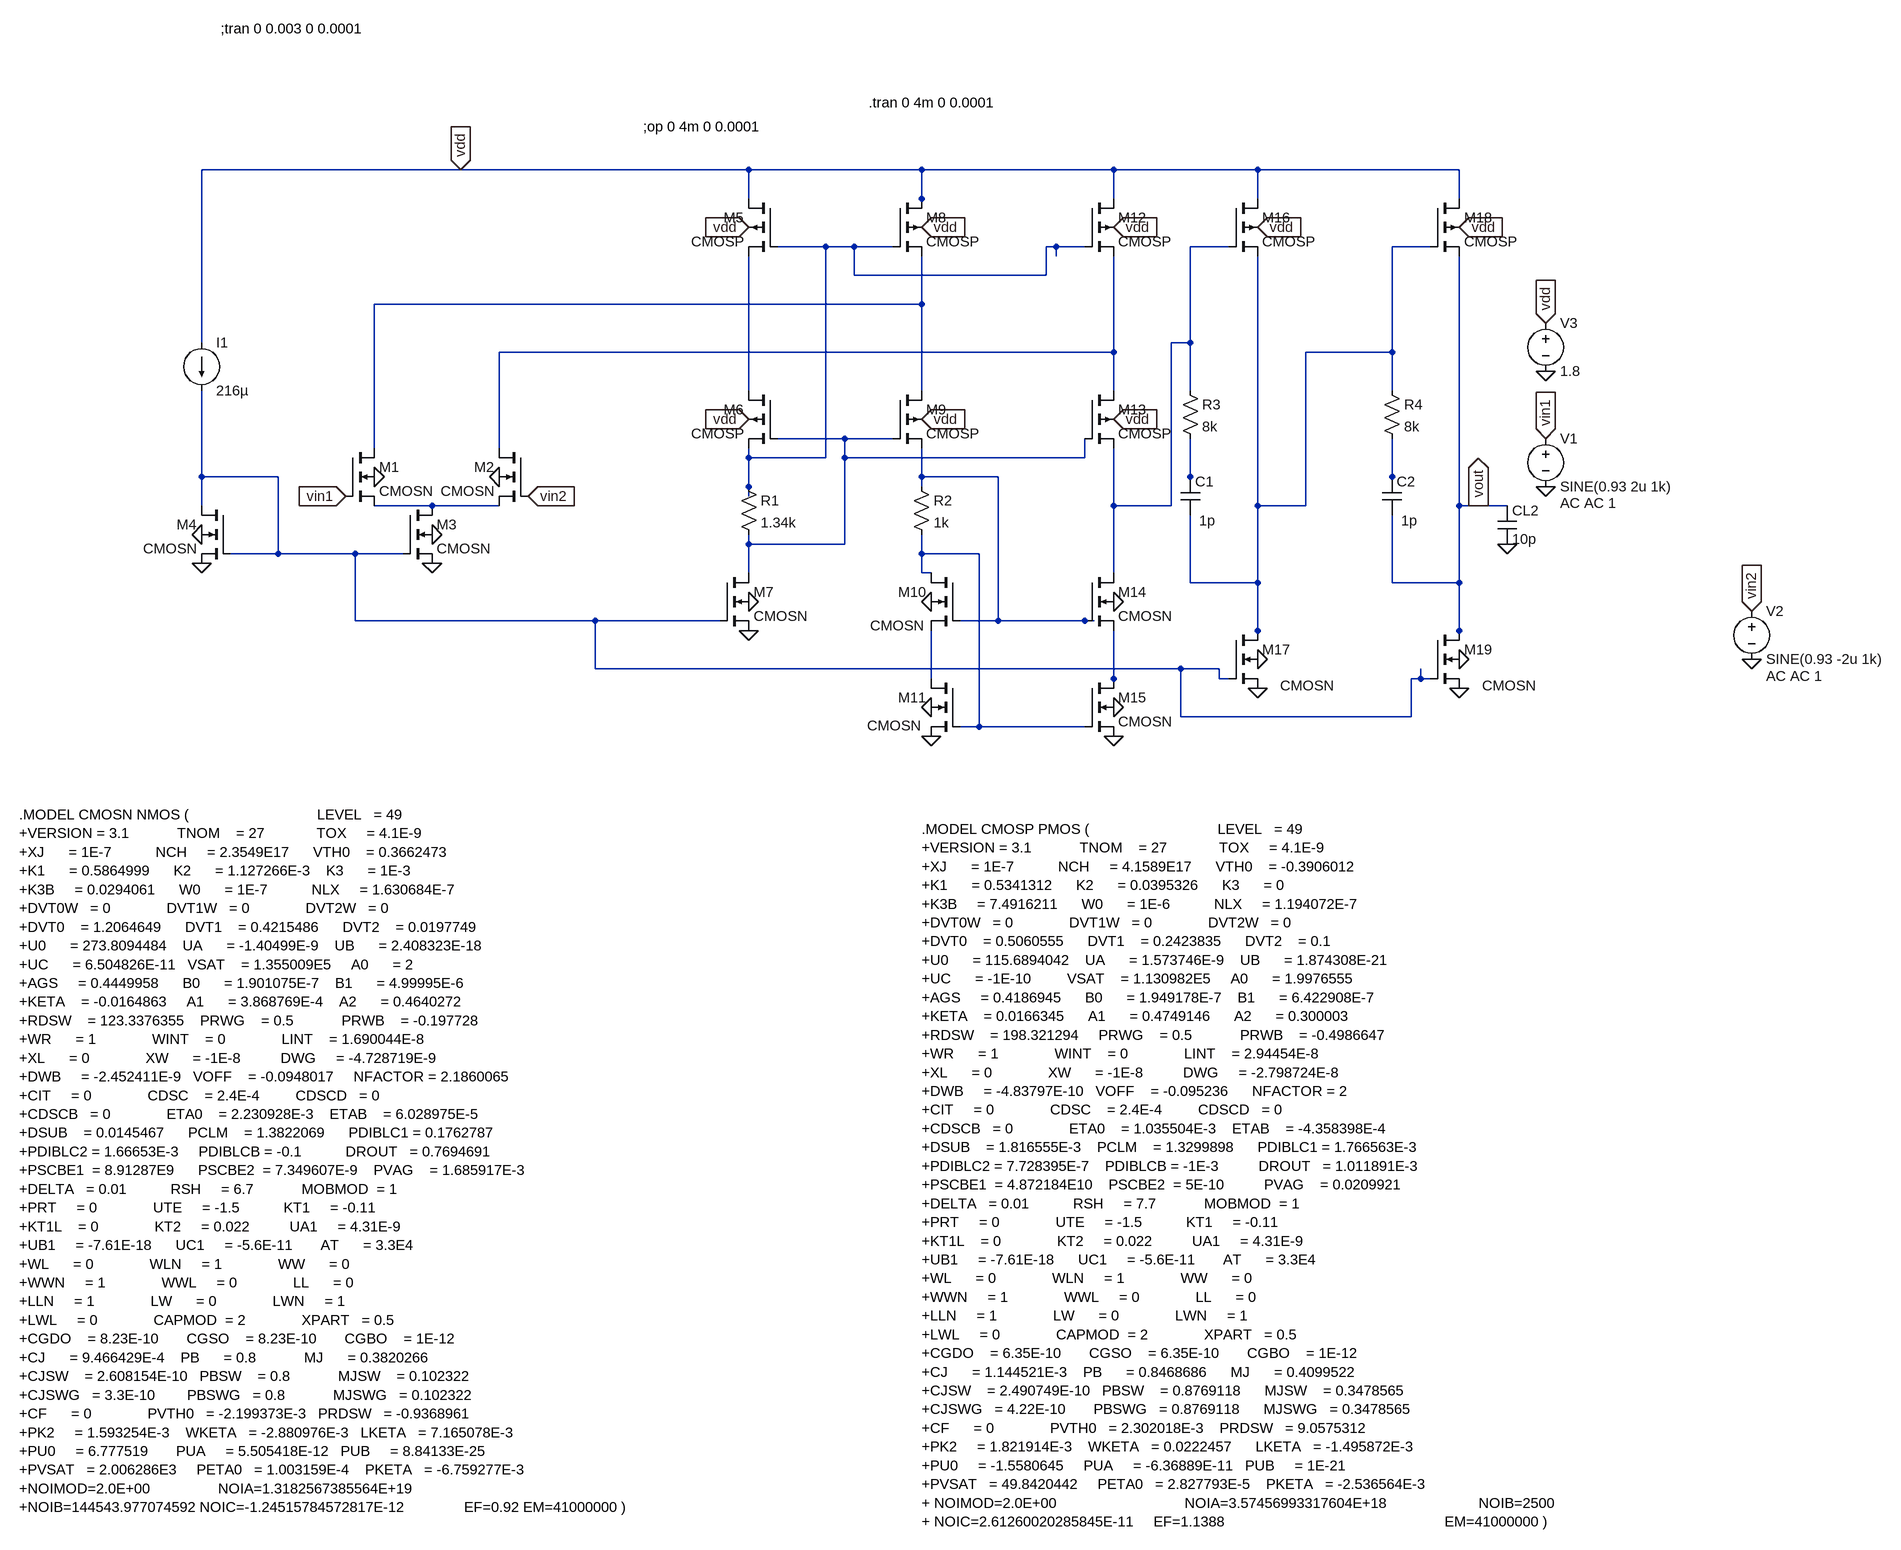
[diagram p0: schematic 3stagefc.asc]
3stagefc.asc, the LTspice schematic file:
Version 4
SHEET 1 2076 2348
WIRE -704 -128 -1136 -128
WIRE -224 -128 -704 -128
WIRE 64 -128 -224 -128
WIRE 384 -128 64 -128
WIRE 624 -128 384 -128
WIRE 960 -128 624 -128
WIRE -224 -80 -224 -128
WIRE 64 -80 64 -128
WIRE 384 -80 384 -128
WIRE 624 -80 624 -128
WIRE 960 -80 960 -128
WIRE 64 -64 64 -80
WIRE -96 0 -176 0
WIRE -48 0 -96 0
WIRE 16 0 -48 0
WIRE 288 0 272 0
WIRE 336 0 288 0
WIRE 576 0 512 0
WIRE 912 0 848 0
WIRE 288 16 288 0
WIRE -48 48 -48 0
WIRE 272 48 272 0
WIRE 272 48 -48 48
WIRE 64 96 64 16
WIRE 64 96 -848 96
WIRE -1136 160 -1136 -128
WIRE 512 160 512 0
WIRE 512 160 480 160
WIRE 384 176 384 16
WIRE 384 176 -640 176
WIRE 848 176 848 0
WIRE 848 176 704 176
WIRE -224 240 -224 16
WIRE 64 240 64 96
WIRE 384 240 384 176
WIRE 512 240 512 160
WIRE 848 240 848 176
WIRE -64 320 -176 320
WIRE 16 320 -64 320
WIRE -848 336 -848 96
WIRE -640 336 -640 176
WIRE -224 352 -224 336
WIRE -96 352 -96 0
WIRE -96 352 -224 352
WIRE -64 352 -64 320
WIRE 336 352 336 320
WIRE 336 352 -64 352
WIRE -1136 384 -1136 240
WIRE -1008 384 -1136 384
WIRE 64 384 64 336
WIRE 192 384 64 384
WIRE 512 384 512 320
WIRE 848 384 848 320
WIRE -224 400 -224 352
WIRE 64 400 64 384
WIRE 512 400 512 384
WIRE 848 400 848 384
WIRE -224 416 -224 400
WIRE -1136 432 -1136 384
WIRE -752 432 -848 432
WIRE -640 432 -752 432
WIRE 384 432 384 336
WIRE 480 432 480 160
WIRE 480 432 384 432
WIRE 624 432 624 16
WIRE 704 432 704 176
WIRE 704 432 624 432
WIRE 960 432 960 16
WIRE 992 432 960 432
WIRE 1040 432 992 432
WIRE -224 496 -224 480
WIRE -64 496 -64 352
WIRE -64 496 -224 496
WIRE -1008 512 -1008 384
WIRE -1008 512 -1088 512
WIRE -880 512 -1008 512
WIRE -800 512 -880 512
WIRE 64 512 64 480
WIRE 160 512 64 512
WIRE -224 544 -224 496
WIRE 64 544 64 512
WIRE 80 544 64 544
WIRE 384 544 384 432
WIRE 512 560 512 448
WIRE 624 560 624 432
WIRE 624 560 512 560
WIRE 848 560 848 448
WIRE 960 560 960 432
WIRE 960 560 848 560
WIRE -880 624 -880 512
WIRE -480 624 -880 624
WIRE -272 624 -480 624
WIRE 192 624 192 384
WIRE 192 624 128 624
WIRE 336 624 192 624
WIRE 352 624 336 624
WIRE 624 640 624 560
WIRE 960 640 960 560
WIRE 624 656 624 640
WIRE 960 656 960 640
WIRE -480 704 -480 624
WIRE 496 704 -480 704
WIRE 560 704 496 704
WIRE 80 720 80 640
WIRE 384 720 384 640
WIRE 560 720 560 704
WIRE 576 720 560 720
WIRE 896 720 896 704
WIRE 896 720 880 720
WIRE 912 720 896 720
WIRE 384 736 384 720
WIRE 496 784 496 704
WIRE 880 784 880 720
WIRE 880 784 496 784
WIRE 160 800 160 512
WIRE 160 800 128 800
WIRE 336 800 160 800
FLAG -752 528 0
FLAG -752 480 0
FLAG -848 384 0
FLAG -640 384 0
FLAG -896 416 vin1
IOPIN -896 416 In
FLAG -592 416 vin2
IOPIN -592 416 In
FLAG 1104 320 vin1
IOPIN 1104 320 In
FLAG 1104 400 0
FLAG 1824 688 0
FLAG 1824 608 vin2
IOPIN 1824 608 In
FLAG 1104 128 vdd
IOPIN 1104 128 In
FLAG 1104 208 0
FLAG -1136 528 0
FLAG -1136 480 0
FLAG -224 -32 vdd
IOPIN -224 -32 In
FLAG -224 288 vdd
IOPIN -224 288 In
FLAG -224 640 0
FLAG -224 592 0
FLAG 80 592 0
FLAG 80 816 0
FLAG 80 768 0
FLAG 64 288 vdd
IOPIN 64 288 In
FLAG 64 -32 vdd
IOPIN 64 -32 In
FLAG 384 816 0
FLAG 384 768 0
FLAG 624 688 0
FLAG 624 736 0
FLAG 384 592 0
FLAG 384 288 vdd
IOPIN 384 288 In
FLAG 384 -32 vdd
IOPIN 384 -32 In
FLAG 624 -32 vdd
IOPIN 624 -32 In
FLAG -704 -128 vdd
IOPIN -704 -128 In
FLAG 960 688 0
FLAG 960 736 0
FLAG 960 -32 vdd
IOPIN 960 -32 In
FLAG 1040 496 0
FLAG 992 432 vout
IOPIN 992 432 Out
SYMBOL nmos4 -896 336 R0
SYMATTR InstName M1
SYMATTR Value CMOSN
SYMATTR Value2 l=0.5u w=30u
SYMBOL nmos4 -592 336 M0
SYMATTR InstName M2
SYMATTR Value CMOSN
SYMATTR Value2 l=0.5u w=30u
SYMBOL nmos4 -800 432 R0
SYMATTR InstName M3
SYMATTR Value CMOSN
SYMATTR Value2 l=0.5u w=7u
SYMBOL voltage 1104 304 R0
WINDOW 123 24 124 Left 2
WINDOW 39 0 0 Left 0
SYMATTR Value2 AC AC 1
SYMATTR InstName V1
SYMATTR Value SINE(0.93 2u 1k)
SYMBOL voltage 1824 592 R0
WINDOW 123 24 124 Left 2
WINDOW 39 0 0 Left 0
SYMATTR Value2 AC AC 1
SYMATTR InstName V2
SYMATTR Value SINE(0.93 -2u 1k)
SYMBOL voltage 1104 112 R0
WINDOW 123 0 0 Left 0
WINDOW 39 0 0 Left 0
SYMATTR InstName V3
SYMATTR Value 1.8
SYMBOL nmos4 -1088 432 M0
SYMATTR InstName M4
SYMATTR Value CMOSN
SYMATTR Value2 l=0.5u w=7u
SYMBOL current -1136 160 R0
WINDOW 123 0 0 Left 0
WINDOW 39 0 0 Left 0
SYMATTR InstName I1
SYMATTR Value 216µ
SYMBOL pmos4 -176 -80 M0
SYMATTR InstName M5
SYMATTR Value CMOSP
SYMATTR Value2 l=0.3u w=170u
SYMBOL pmos4 -176 240 M0
SYMATTR InstName M6
SYMATTR Value CMOSP
SYMATTR Value2 l=0.3u w=170u
SYMBOL nmos4 -272 544 R0
SYMATTR InstName M7
SYMATTR Value CMOSN
SYMATTR Value2 l=0.5u w=9u
SYMBOL res -240 384 R0
SYMATTR InstName R1
SYMATTR Value 1.34k
SYMBOL pmos4 16 -80 R0
SYMATTR InstName M8
SYMATTR Value CMOSP
SYMATTR Value2 l=0.3u w=170u
SYMBOL pmos4 16 240 R0
SYMATTR InstName M9
SYMATTR Value CMOSP
SYMATTR Value2 l=0.3u w=170u
SYMBOL res 48 384 R0
SYMATTR InstName R2
SYMATTR Value 1k
SYMBOL nmos4 128 544 M0
WINDOW 3 60 88 Left 2
SYMATTR Value CMOSN
SYMATTR InstName M10
SYMATTR Value2 l=0.5u w=70u
SYMBOL nmos4 128 720 M0
WINDOW 3 65 79 Left 2
SYMATTR Value CMOSN
SYMATTR InstName M11
SYMATTR Value2 l=0.5u w=70u
SYMBOL pmos4 336 -80 R0
SYMATTR InstName M12
SYMATTR Value CMOSP
SYMATTR Value2 l=0.3u w=170u
SYMBOL pmos4 336 240 R0
SYMATTR InstName M13
SYMATTR Value CMOSP
SYMATTR Value2 l=0.3u w=170u
SYMBOL nmos4 336 544 R0
SYMATTR InstName M14
SYMATTR Value CMOSN
SYMATTR Value2 l=0.5u w=70u
SYMBOL nmos4 336 720 R0
SYMATTR InstName M15
SYMATTR Value CMOSN
SYMATTR Value2 l=0.5u w=70u
SYMBOL pmos4 576 -80 R0
SYMATTR InstName M16
SYMATTR Value CMOSP
SYMATTR Value2 l=0.5u w=30u
SYMBOL nmos4 576 640 R0
WINDOW 3 86 92 Left 2
SYMATTR Value CMOSN
SYMATTR InstName M17
SYMATTR Value2 l=0.5u w=30u
SYMBOL cap 496 384 R0
WINDOW 3 31 73 Left 2
SYMATTR Value 1p
SYMATTR InstName C1
SYMBOL res 496 224 R0
SYMATTR InstName R3
SYMATTR Value 8k
SYMBOL pmos4 912 -80 R0
SYMATTR InstName M18
SYMATTR Value CMOSP
SYMATTR Value2 l=0.5u w=10u
SYMBOL nmos4 912 640 R0
WINDOW 3 86 92 Left 2
SYMATTR Value CMOSN
SYMATTR InstName M19
SYMATTR Value2 l=0.5u w=10u
SYMBOL cap 832 384 R0
WINDOW 3 31 73 Left 2
SYMATTR Value 1p
SYMATTR InstName C2
SYMBOL cap 1024 432 R0
SYMATTR InstName CL2
SYMATTR Value 10p
SYMBOL res 832 224 R0
SYMATTR InstName R4
SYMATTR Value 8k
TEXT -1104 -480 Left 2 !;tran 0 0.003 0 0.0001
TEXT -24 -240 Left 2 !.tran 0 4m 0 0.0001
TEXT -1440 1272 Left 2 !.MODEL CMOSN NMOS (                                LEVEL   = 49\n+VERSION = 3.1            TNOM    = 27             TOX     = 4.1E-9\n+XJ      = 1E-7           NCH     = 2.3549E17      VTH0    = 0.3662473\n+K1      = 0.5864999      K2      = 1.127266E-3    K3      = 1E-3\n+K3B     = 0.0294061      W0      = 1E-7           NLX     = 1.630684E-7\n+DVT0W   = 0              DVT1W   = 0              DVT2W   = 0\n+DVT0    = 1.2064649      DVT1    = 0.4215486      DVT2    = 0.0197749\n+U0      = 273.8094484    UA      = -1.40499E-9    UB      = 2.408323E-18\n+UC      = 6.504826E-11   VSAT    = 1.355009E5     A0      = 2\n+AGS     = 0.4449958      B0      = 1.901075E-7    B1      = 4.99995E-6\n+KETA    = -0.0164863     A1      = 3.868769E-4    A2      = 0.4640272\n+RDSW    = 123.3376355    PRWG    = 0.5            PRWB    = -0.197728\n+WR      = 1              WINT    = 0              LINT    = 1.690044E-8\n+XL      = 0              XW      = -1E-8          DWG     = -4.728719E-9\n+DWB     = -2.452411E-9   VOFF    = -0.0948017     NFACTOR = 2.1860065\n+CIT     = 0              CDSC    = 2.4E-4         CDSCD   = 0\n+CDSCB   = 0              ETA0    = 2.230928E-3    ETAB    = 6.028975E-5\n+DSUB    = 0.0145467      PCLM    = 1.3822069      PDIBLC1 = 0.1762787\n+PDIBLC2 = 1.66653E-3     PDIBLCB = -0.1           DROUT   = 0.7694691\n+PSCBE1  = 8.91287E9      PSCBE2  = 7.349607E-9    PVAG    = 1.685917E-3\n+DELTA   = 0.01           RSH     = 6.7            MOBMOD  = 1\n+PRT     = 0              UTE     = -1.5           KT1     = -0.11\n+KT1L    = 0              KT2     = 0.022          UA1     = 4.31E-9\n+UB1     = -7.61E-18      UC1     = -5.6E-11       AT      = 3.3E4\n+WL      = 0              WLN     = 1              WW      = 0\n+WWN     = 1              WWL     = 0              LL      = 0\n+LLN     = 1              LW      = 0              LWN     = 1\n+LWL     = 0              CAPMOD  = 2              XPART   = 0.5\n+CGDO    = 8.23E-10       CGSO    = 8.23E-10       CGBO    = 1E-12\n+CJ      = 9.466429E-4    PB      = 0.8            MJ      = 0.3820266\n+CJSW    = 2.608154E-10   PBSW    = 0.8            MJSW    = 0.102322\n+CJSWG   = 3.3E-10        PBSWG   = 0.8            MJSWG   = 0.102322\n+CF      = 0              PVTH0   = -2.199373E-3   PRDSW   = -0.9368961\n+PK2     = 1.593254E-3    WKETA   = -2.880976E-3   LKETA   = 7.165078E-3\n+PU0     = 6.777519       PUA     = 5.505418E-12   PUB     = 8.84133E-25\n+PVSAT   = 2.006286E3     PETA0   = 1.003159E-4    PKETA   = -6.759277E-3\n+NOIMOD=2.0E+00                 NOIA=1.3182567385564E+19\n+NOIB=144543.977074592 NOIC=-1.24515784572817E-12               EF=0.92 EM=41000000 )
TEXT 64 1296 Left 2 !.MODEL CMOSP PMOS (                                LEVEL   = 49\n+VERSION = 3.1            TNOM    = 27             TOX     = 4.1E-9\n+XJ      = 1E-7           NCH     = 4.1589E17      VTH0    = -0.3906012\n+K1      = 0.5341312      K2      = 0.0395326      K3      = 0\n+K3B     = 7.4916211      W0      = 1E-6           NLX     = 1.194072E-7\n+DVT0W   = 0              DVT1W   = 0              DVT2W   = 0\n+DVT0    = 0.5060555      DVT1    = 0.2423835      DVT2    = 0.1\n+U0      = 115.6894042    UA      = 1.573746E-9    UB      = 1.874308E-21\n+UC      = -1E-10         VSAT    = 1.130982E5     A0      = 1.9976555\n+AGS     = 0.4186945      B0      = 1.949178E-7    B1      = 6.422908E-7\n+KETA    = 0.0166345      A1      = 0.4749146      A2      = 0.300003\n+RDSW    = 198.321294     PRWG    = 0.5            PRWB    = -0.4986647\n+WR      = 1              WINT    = 0              LINT    = 2.94454E-8\n+XL      = 0              XW      = -1E-8          DWG     = -2.798724E-8\n+DWB     = -4.83797E-10   VOFF    = -0.095236      NFACTOR = 2\n+CIT     = 0              CDSC    = 2.4E-4         CDSCD   = 0\n+CDSCB   = 0              ETA0    = 1.035504E-3    ETAB    = -4.358398E-4\n+DSUB    = 1.816555E-3    PCLM    = 1.3299898      PDIBLC1 = 1.766563E-3\n+PDIBLC2 = 7.728395E-7    PDIBLCB = -1E-3          DROUT   = 1.011891E-3\n+PSCBE1  = 4.872184E10    PSCBE2  = 5E-10          PVAG    = 0.0209921\n+DELTA   = 0.01           RSH     = 7.7            MOBMOD  = 1\n+PRT     = 0              UTE     = -1.5           KT1     = -0.11\n+KT1L    = 0              KT2     = 0.022          UA1     = 4.31E-9\n+UB1     = -7.61E-18      UC1     = -5.6E-11       AT      = 3.3E4\n+WL      = 0              WLN     = 1              WW      = 0\n+WWN     = 1              WWL     = 0              LL      = 0\n+LLN     = 1              LW      = 0              LWN     = 1\n+LWL     = 0              CAPMOD  = 2              XPART   = 0.5\n+CGDO    = 6.35E-10       CGSO    = 6.35E-10       CGBO    = 1E-12\n+CJ      = 1.144521E-3    PB      = 0.8468686      MJ      = 0.4099522\n+CJSW    = 2.490749E-10   PBSW    = 0.8769118      MJSW    = 0.3478565\n+CJSWG   = 4.22E-10       PBSWG   = 0.8769118      MJSWG   = 0.3478565\n+CF      = 0              PVTH0   = 2.302018E-3    PRDSW   = 9.0575312\n+PK2     = 1.821914E-3    WKETA   = 0.0222457      LKETA   = -1.495872E-3\n+PU0     = -1.5580645     PUA     = -6.36889E-11   PUB     = 1E-21\n+PVSAT   = 49.8420442     PETA0   = 2.827793E-5    PKETA   = -2.536564E-3 \n+ NOIMOD=2.0E+00                                NOIA=3.57456993317604E+18                       NOIB=2500\n+ NOIC=2.61260020285845E-11     EF=1.1388                                                       EM=41000000 )
TEXT -400 -200 Left 2 !;op 0 4m 0 0.0001

The netlist it stands for:
* 3stagefc.asc
M1 N004 vin1 N012 0 CMOSN l=0.5u w=30u
M2 N005 vin2 N012 0 CMOSN l=0.5u w=30u
M3 N012 N008 0 0 CMOSN l=0.5u w=7u
V1 vin1 0 SINE(0.93 2u 1k) AC AC 1
V2 vin2 0 SINE(0.93 -2u 1k) AC AC 1
V3 vdd 0 1.8
M4 N008 N008 0 0 CMOSN l=0.5u w=7u
I1 vdd N008 216µ
M5 vdd N001 N006 vdd CMOSP l=0.3u w=170u
M6 N006 N007 N001 vdd CMOSP l=0.3u w=170u
M7 N007 N008 0 0 CMOSN l=0.5u w=9u
R1 N001 N007 1.34k
M8 vdd N001 N004 vdd CMOSP l=0.3u w=170u
M9 N004 N007 N009 vdd CMOSP l=0.3u w=170u
R2 N009 N013 1k
M10 N013 N009 N014 0 CMOSN l=0.5u w=70u
M11 N014 N013 0 0 CMOSN l=0.5u w=70u
M12 vdd N001 N005 vdd CMOSP l=0.3u w=170u
M13 N005 N007 N002 vdd CMOSP l=0.3u w=170u
M14 N002 N009 N015 0 CMOSN l=0.5u w=70u
M15 N015 N013 0 0 CMOSN l=0.5u w=70u
M16 vdd N002 N003 vdd CMOSP l=0.5u w=30u
M17 N003 N008 0 0 CMOSN l=0.5u w=30u
C1 N010 N003 1p
R3 N002 N010 8k
M18 vdd N003 vout vdd CMOSP l=0.5u w=10u
M19 vout N008 0 0 CMOSN l=0.5u w=10u
C2 N011 vout 1p
CL2 vout 0 10p
R4 N003 N011 8k
.model NMOS NMOS
.model PMOS PMOS
.lib standard.mos
;tran 0 0.003 0 0.0001
.tran 0 4m 0 0.0001
.MODEL CMOSN NMOS (                                LEVEL   = 49
+VERSION = 3.1            TNOM    = 27             TOX     = 4.1E-9
+XJ      = 1E-7           NCH     = 2.3549E17      VTH0    = 0.3662473
+K1      = 0.5864999      K2      = 1.127266E-3    K3      = 1E-3
+K3B     = 0.0294061      W0      = 1E-7           NLX     = 1.630684E-7
+DVT0W   = 0              DVT1W   = 0              DVT2W   = 0
+DVT0    = 1.2064649      DVT1    = 0.4215486      DVT2    = 0.0197749
+U0      = 273.8094484    UA      = -1.40499E-9    UB      = 2.408323E-18
+UC      = 6.504826E-11   VSAT    = 1.355009E5     A0      = 2
+AGS     = 0.4449958      B0      = 1.901075E-7    B1      = 4.99995E-6
+KETA    = -0.0164863     A1      = 3.868769E-4    A2      = 0.4640272
+RDSW    = 123.3376355    PRWG    = 0.5            PRWB    = -0.197728
+WR      = 1              WINT    = 0              LINT    = 1.690044E-8
+XL      = 0              XW      = -1E-8          DWG     = -4.728719E-9
+DWB     = -2.452411E-9   VOFF    = -0.0948017     NFACTOR = 2.1860065
+CIT     = 0              CDSC    = 2.4E-4         CDSCD   = 0
+CDSCB   = 0              ETA0    = 2.230928E-3    ETAB    = 6.028975E-5
+DSUB    = 0.0145467      PCLM    = 1.3822069      PDIBLC1 = 0.1762787
+PDIBLC2 = 1.66653E-3     PDIBLCB = -0.1           DROUT   = 0.7694691
+PSCBE1  = 8.91287E9      PSCBE2  = 7.349607E-9    PVAG    = 1.685917E-3
+DELTA   = 0.01           RSH     = 6.7            MOBMOD  = 1
+PRT     = 0              UTE     = -1.5           KT1     = -0.11
+KT1L    = 0              KT2     = 0.022          UA1     = 4.31E-9
+UB1     = -7.61E-18      UC1     = -5.6E-11       AT      = 3.3E4
+WL      = 0              WLN     = 1              WW      = 0
+WWN     = 1              WWL     = 0              LL      = 0
+LLN     = 1              LW      = 0              LWN     = 1
+LWL     = 0              CAPMOD  = 2              XPART   = 0.5
+CGDO    = 8.23E-10       CGSO    = 8.23E-10       CGBO    = 1E-12
+CJ      = 9.466429E-4    PB      = 0.8            MJ      = 0.3820266
+CJSW    = 2.608154E-10   PBSW    = 0.8            MJSW    = 0.102322
+CJSWG   = 3.3E-10        PBSWG   = 0.8            MJSWG   = 0.102322
+CF      = 0              PVTH0   = -2.199373E-3   PRDSW   = -0.9368961
+PK2     = 1.593254E-3    WKETA   = -2.880976E-3   LKETA   = 7.165078E-3
+PU0     = 6.777519       PUA     = 5.505418E-12   PUB     = 8.84133E-25
+PVSAT   = 2.006286E3     PETA0   = 1.003159E-4    PKETA   = -6.759277E-3
+NOIMOD=2.0E+00                 NOIA=1.3182567385564E+19
+NOIB=144543.977074592 NOIC=-1.24515784572817E-12               EF=0.92 EM=41000000 )
.MODEL CMOSP PMOS (                                LEVEL   = 49
+VERSION = 3.1            TNOM    = 27             TOX     = 4.1E-9
+XJ      = 1E-7           NCH     = 4.1589E17      VTH0    = -0.3906012
+K1      = 0.5341312      K2      = 0.0395326      K3      = 0
+K3B     = 7.4916211      W0      = 1E-6           NLX     = 1.194072E-7
+DVT0W   = 0              DVT1W   = 0              DVT2W   = 0
+DVT0    = 0.5060555      DVT1    = 0.2423835      DVT2    = 0.1
+U0      = 115.6894042    UA      = 1.573746E-9    UB      = 1.874308E-21
+UC      = -1E-10         VSAT    = 1.130982E5     A0      = 1.9976555
+AGS     = 0.4186945      B0      = 1.949178E-7    B1      = 6.422908E-7
+KETA    = 0.0166345      A1      = 0.4749146      A2      = 0.300003
+RDSW    = 198.321294     PRWG    = 0.5            PRWB    = -0.4986647
+WR      = 1              WINT    = 0              LINT    = 2.94454E-8
+XL      = 0              XW      = -1E-8          DWG     = -2.798724E-8
+DWB     = -4.83797E-10   VOFF    = -0.095236      NFACTOR = 2
+CIT     = 0              CDSC    = 2.4E-4         CDSCD   = 0
+CDSCB   = 0              ETA0    = 1.035504E-3    ETAB    = -4.358398E-4
+DSUB    = 1.816555E-3    PCLM    = 1.3299898      PDIBLC1 = 1.766563E-3
+PDIBLC2 = 7.728395E-7    PDIBLCB = -1E-3          DROUT   = 1.011891E-3
+PSCBE1  = 4.872184E10    PSCBE2  = 5E-10          PVAG    = 0.0209921
+DELTA   = 0.01           RSH     = 7.7            MOBMOD  = 1
+PRT     = 0              UTE     = -1.5           KT1     = -0.11
+KT1L    = 0              KT2     = 0.022          UA1     = 4.31E-9
+UB1     = -7.61E-18      UC1     = -5.6E-11       AT      = 3.3E4
+WL      = 0              WLN     = 1              WW      = 0
+WWN     = 1              WWL     = 0              LL      = 0
+LLN     = 1              LW      = 0              LWN     = 1
+LWL     = 0              CAPMOD  = 2              XPART   = 0.5
+CGDO    = 6.35E-10       CGSO    = 6.35E-10       CGBO    = 1E-12
+CJ      = 1.144521E-3    PB      = 0.8468686      MJ      = 0.4099522
+CJSW    = 2.490749E-10   PBSW    = 0.8769118      MJSW    = 0.3478565
+CJSWG   = 4.22E-10       PBSWG   = 0.8769118      MJSWG   = 0.3478565
+CF      = 0              PVTH0   = 2.302018E-3    PRDSW   = 9.0575312
+PK2     = 1.821914E-3    WKETA   = 0.0222457      LKETA   = -1.495872E-3
+PU0     = -1.5580645     PUA     = -6.36889E-11   PUB     = 1E-21
+PVSAT   = 49.8420442     PETA0   = 2.827793E-5    PKETA   = -2.536564E-3
+ NOIMOD=2.0E+00                                NOIA=3.57456993317604E+18                       NOIB=2500
+ NOIC=2.61260020285845E-11     EF=1.1388                                                       EM=41000000 )
;op 0 4m 0 0.0001
.backanno
.end